# Altium project POWER_SUPPLY.PrjPcb (part 5 of 8)
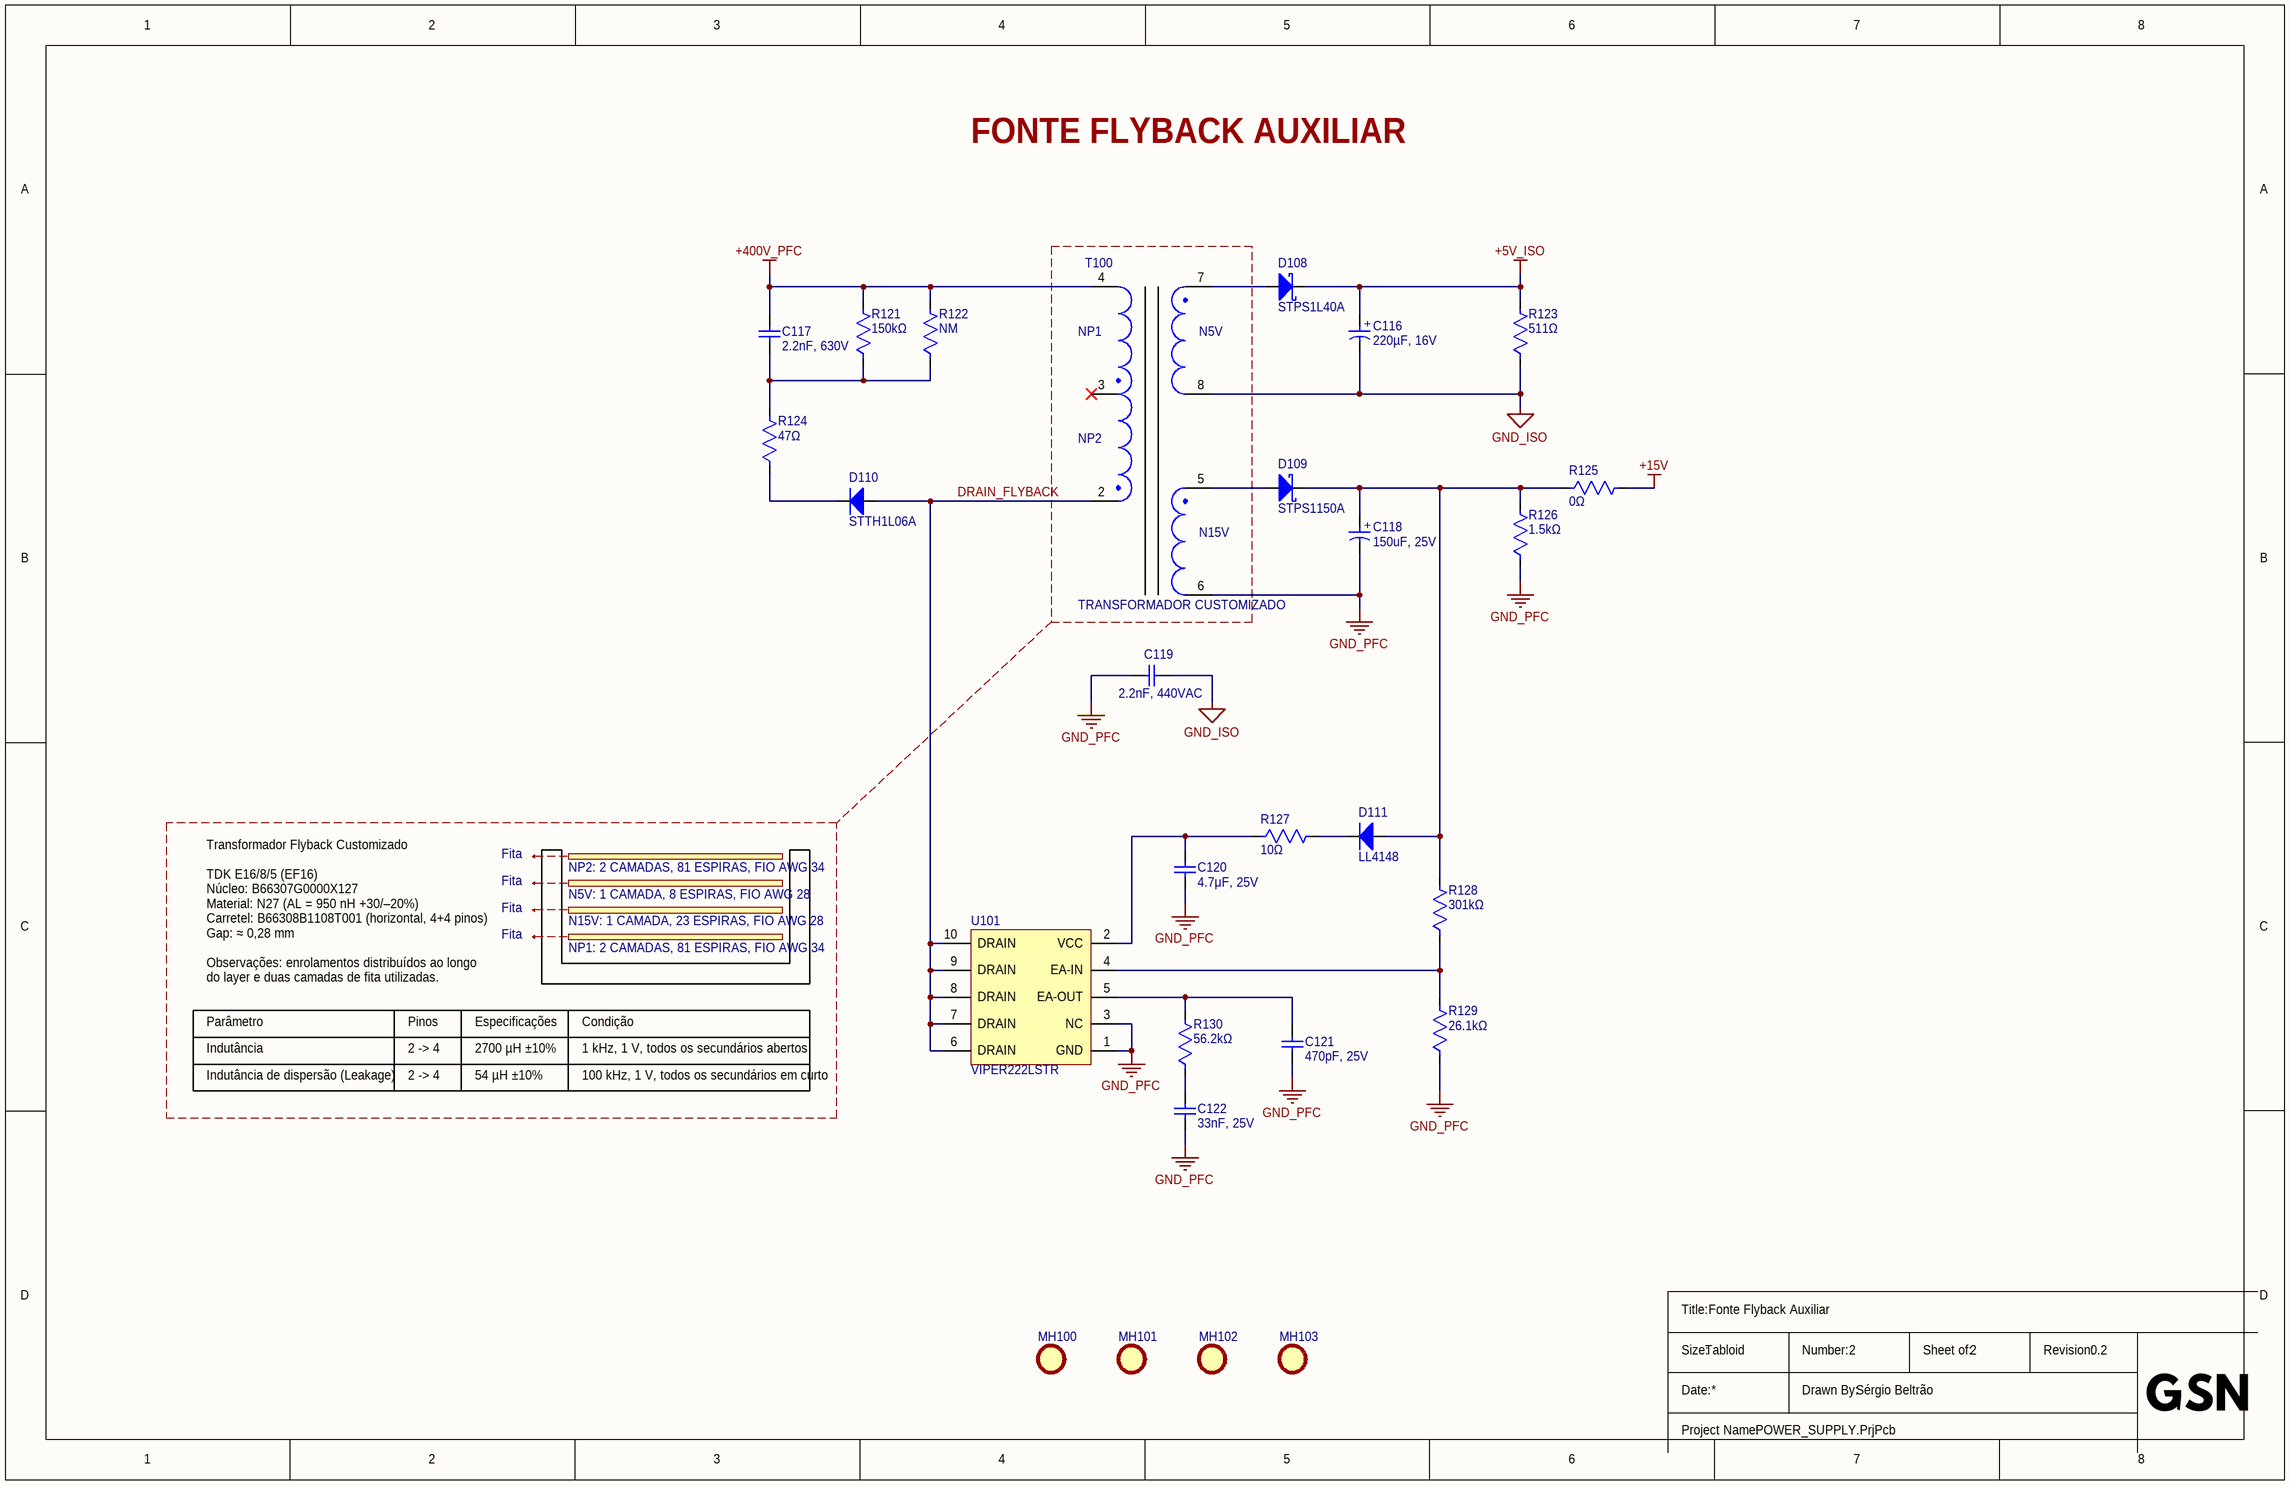
[diagram p6: 2_FLYBACK_AUXILIAR.SchDoc]

## Sheet 2_FLYBACK_AUXILIAR.SchDoc (continued)
### Library data of the parts
C116 = 860040374004: WCAP-ATUL Aluminum Electrolytic Capacitor, Radial, THT, 8mm x 11.5mm, 220µF, 16V; Manufacturer: Wurth Elektronik; Capacitance Tolerance: 20%; Dissipation Factor: 16%; Endurance: 7000h; Leakage Current: 35.2µA; Ripple Current: 480mA; Manufacturer Part Number: 860040374004; Category: Aluminum Electrolytic Capacitors; Match Code: WCAP-ATUL; ComponentLink1Description: Website Link; ComponentLink1URL: https://www.we-online.com/redexpert/article/860040374004?ad; ComponentLink2Description: Datasheet Link; ComponentLink2URL: https://www.we-online.com/redexpert/spec/860040374004?ad; Mount: Through Hole; Operating Temperature Min: -40°C; Operating Temperature Max: 105°C; Packaging: Ammo Pack; Height: 11.5mm; Diameter: 8mm; Capacitance: 220µF; Rated Voltage (DC): 16V
C117 = 885342008007: WCAP-CSMH Multilayer Ceramic Chip Capacitor Mid and High Voltage, SMT, size 1206, NP0 Class I, 2.2nF, 630V; Manufacturer: Wurth Elektronik; Case/Size Code: 1206; Capacitance Tolerance: +/-5%; Insulation Resistance: 10GΩ; Q Factor Min: 1000; Manufacturer Part Number: 885342008007; Category: Multilayer Ceramic Chip Capacitors; Match Code: WCAP-CSMH; ComponentLink1Description: Website Link; ComponentLink1URL: https://www.we-online.com/redexpert/article/885342008007?ad; ComponentLink2Description: Datasheet Link; ComponentLink2URL: https://www.we-online.com/redexpert/spec/885342008007?ad; Mount: Surface Mount; Operating Temperature Min: -55°C; Operating Temperature Max: 125°C; Packaging: Tape and Reel; Length: 3.2mm; Width: 1.6mm; Height: 1.6mm; Capacitance: 2.2nF; Ceramic Type: NP0 Class I; Rated Voltage (DC): 630V
C118 = 860080474008: WCAP-ATLI Aluminum Electrolytic Capacitor, Radial, THT, D8 x H11.5mm, 150µF, 25V; Manufacturer: Wurth Elektronik; Capacitance Tolerance: +/-20%; Dissipation Factor: 10%; Endurance: 3000h; Leakage Current: 37.5uA; Ripple Current: 540mA; Technical Reference: ATEE115151M025DSPA7C000; Manufacturer Part Number: 860080474008; Category: Aluminum Electrolytic Capacitors; Match Code: WCAP-ATLI; ComponentLink1Description: Website Link; ComponentLink1URL: https://www.we-online.com/redexpert/article/860080474008?ad; ComponentLink2Description: Datasheet Link; ComponentLink2URL: https://www.we-online.com/redexpert/spec/860080474008?ad; Mount: Through Hole; Operating Temperature Min: -55°C; Operating Temperature Max: 105°C; Packaging: Ammo Pack; Height: 11.5mm; Diameter: 8mm; Capacitance: 150uF; Rated Voltage (DC): 25V
C119 = VY2222M35Y5US63V7: CAP CER 2200PF 440VAC Y5U RADIAL; Manufacturer: Vishay; Dielectric Material: Ceramic; Lead/Base Style: Kinked; Lead Diameter: 600µm; Lead Length: 30mm; Tolerance: 20%; Voltage: 250V; Voltage Rating: 1kV; Voltage Rating (AC): 300V; Supplier: DigiKey; Supplier Part Number: BC2356-ND; Manufacturer Part Number: VY2222M35Y5US63V7; RoHS: Compliant; Category: Ceramic Capacitors; Stock: 12709; Pricing: 1=0.48, 10=0.288, 50=0.2152, 100=0.1928, 500=0.15486, 1000=0.14314, 3000=0.12868, 5000=0.12334 (USD); Value: 2.2nF; Case/Package: Radial; Composition: Ceramic; Contact Plating: Tin; Depth: 5mm; Diameter: 9mm; Dielectric: Y5U; Export Control Classification Number (ECCN) Code: EAR99; Height: 9mm; Height - Seated (Max): 13.0048mm; Harmonized Tariff Schedule (HTS) Code: 8532.23.00.60; Lead Free: Lead Free; Lead Pitch: 7.5mm; Length: 9mm; Lifecycle Status: Production; Material: Ceramic; Max Operating Temperature: 125°C; Min Operating Temperature: -40°C; Mounting Technology: PCB, Through Hole; Number of Terminals: 2; Packaging: Bulk; Radiation Hardening: No; REACH SVHC: Yes; Schedule B: 8532230060, 8532230060|8532230060, 8532230060|8532230060|8532230060, 8532230060|8532230060|8532230060|8532230060; Terminal Pitch: 7.5mm; Termination: Radial; Voltage Rating (DC): 1kV; Width: 5mm; ComponentLink1URL: https://datasheet.octopart.com:443/VY2222M35Y5US63V7-Vishay-datasheet-182139072.pdf?src-supplier=IHS; ComponentLink1Description: https://datasheet.octopart.com:443/VY2222M35Y5US63V7-Vishay-datasheet-182139072.pdf?src-supplier=IHS; ComponentLink2URL: https://datasheet.octopart.com:443/VY2222M35Y5US63V7-Vishay-datasheet-182137621.pdf?src-supplier=IHS; ComponentLink2Description: https://datasheet.octopart.com:443/VY2222M35Y5US63V7-Vishay-datasheet-182137621.pdf?src-supplier=IHS; ComponentLink3URL: https://datasheet.octopart.com:443/VY2222M35Y5US63V7-Vishay-BCcomponents-datasheet-138899136.pdf?src-supplier=Upverter; ComponentLink3Description: https://datasheet.octopart.com:443/VY2222M35Y5US63V7-Vishay-BCcomponents-datasheet-138899136.pdf?src-supplier=Upverter; ComponentLink4URL: https://datasheet.octopart.com:443/VY2222M35Y5US63V7-Vishay-datasheet-62321353.pdf?src-supplier=Farnell; ComponentLink4Description: https://datasheet.octopart.com:443/VY2222M35Y5US63V7-Vishay-datasheet-62321353.pdf?src-supplier=Farnell; ComponentLink5URL: https://datasheet.octopart.com:443/VY2222M35Y5US63V7-Vishay-datasheet-15070738.pdf?src-supplier=Farnell; ComponentLink5Description: https://datasheet.octopart.com:443/VY2222M35Y5US63V7-Vishay-datasheet-15070738.pdf?src-supplier=Farnell; ComponentLink6URL: https://datasheet.octopart.com:443/VY2222M35Y5US63V7-Vishay-datasheet-10380040.pdf?src-supplier=element14+APAC; ComponentLink6Description: https://datasheet.octopart.com:443/VY2222M35Y5US63V7-Vishay-datasheet-10380040.pdf?src-supplier=element14+APAC; ComponentLink7URL: https://datasheet.octopart.com:443/VY2222M35Y5US63V7-Vishay-datasheet-13530909.pdf?src-supplier=Future+Electronics; ComponentLink7Description: https://datasheet.octopart.com:443/VY2222M35Y5US63V7-Vishay-datasheet-13530909.pdf?src-supplier=Future+Electronics; ComponentLink8URL: https://datasheet.octopart.com:443/VY2222M35Y5US63V7-Vishay-datasheet-13402494.pdf?src-supplier=Future+Electronics; ComponentLink8Description: https://datasheet.octopart.com:443/VY2222M35Y5US63V7-Vishay-datasheet-13402494.pdf?src-supplier=Future+Electronics; ComponentLink9URL: https://datasheet.octopart.com:443/VY2222M35Y5US63V7-Vishay-datasheet-13168647.pdf?src-supplier=Future+Electronics; ComponentLink9Description: https://datasheet.octopart.com:443/VY2222M35Y5US63V7-Vishay-datasheet-13168647.pdf?src-supplier=Future+Electronics; ComponentLink10URL: https://datasheet.octopart.com:443/VY2222M35Y5US63V7-Vishay-datasheet-13030022.pdf?src-supplier=Future+Electronics; ComponentLink10Description: https://datasheet.octopart.com:443/VY2222M35Y5US63V7-Vishay-datasheet-13030022.pdf?src-supplier=Future+Electronics; ComponentLink11URL: https://datasheet.octopart.com:443/VY2222M35Y5US63V7-Vishay-datasheet-12553972.pdf?src-supplier=Future+Electronics; ComponentLink11Description: https://datasheet.octopart.com:443/VY2222M35Y5US63V7-Vishay-datasheet-12553972.pdf?src-supplier=Future+Electronics; ComponentLink12URL: https://datasheet.octopart.com:443/VY2222M35Y5US63V7-Vishay-datasheet-12524127.pdf?src-supplier=Future+Electronics; ComponentLink12Description: https://datasheet.octopart.com:443/VY2222M35Y5US63V7-Vishay-datasheet-12524127.pdf?src-supplier=Future+Electronics; ComponentLink13URL: https://datasheet.octopart.com:443/VY2222M35Y5US63V7-Vishay-datasheet-12510687.pdf?src-supplier=Future+Electronics; ComponentLink13Description: https://datasheet.octopart.com:443/VY2222M35Y5US63V7-Vishay-datasheet-12510687.pdf?src-supplier=Future+Electronics; ComponentLink14URL: https://datasheet.octopart.com:443/VY2222M35Y5US63V7-Vishay-datasheet-27584505.pdf?src-supplier=Future+Electronics; ComponentLink14Description: https://datasheet.octopart.com:443/VY2222M35Y5US63V7-Vishay-datasheet-27584505.pdf?src-supplier=Future+Electronics; ComponentLink15URL: https://datasheet.octopart.com:443/VY2222M35Y5US63V7-Vishay-datasheet-9918016.pdf?src-supplier=RS+(Formerly+Allied+Electronics); ComponentLink15Description: https://datasheet.octopart.com:443/VY2222M35Y5US63V7-Vishay-datasheet-9918016.pdf?src-supplier=RS+(Formerly+Allied+Electronics); ComponentLink16URL: http://sigma.octopart.com:80/rohs_statement/Vishay-company-15.pdf?src-supplier=Compliance+Statements; ComponentLink16Description: http://sigma.octopart.com:80/rohs_statement/Vishay-company-15.pdf?src-supplier=Compliance+Statements
C120 = 885012107018: WCAP-CSGP Multilayer Ceramic Chip Capacitor, General Purpose, size 0805, 4.7μF, 25V; Manufacturer: Wurth Elektronik; Case/Size Code: 0805; Capacitance Tolerance: +/-20%; Ceramic Type: X5R; Dissipation Factor: 10%; Insulation Resistance: 0.02GΩ; Technical Reference: X5R0805475M025DFCT10000; Manufacturer Part Number: 885012107018; Category: Multilayer Ceramic Chip Capacitors; Match Code: WCAP-CSGP; ComponentLink1Description: Website Link; ComponentLink1URL: https://www.we-online.com/redexpert/article/885012107018?ad; ComponentLink2Description: Datasheet Link; ComponentLink2URL: https://www.we-online.com/redexpert/spec/885012107018?ad; Mount: Surface Mount; Operating Temperature Min: -55°C; Operating Temperature Max: 85°C; Packaging: Tape and Reel; Length: 2mm; Width: 1.25mm; Height: 1.25mm; Capacitance: 4.7μF; Rated Voltage (DC): 25V
C121 = 885012006042: WCAP-CSGP Multilayer Ceramic Chip Capacitor, General Purpose, size 0603, 470pF, 25V; Manufacturer: Wurth Elektronik; Case/Size Code: 0603; Capacitance Tolerance: +/-5%; Ceramic Type: NP0; Insulation Resistance: 10GΩ; Q Factor: 1000; Technical Reference: NP00603471J025DFCT10000; Manufacturer Part Number: 885012006042; Category: Multilayer Ceramic Chip Capacitors; Match Code: WCAP-CSGP; ComponentLink1Description: Website Link; ComponentLink1URL: https://www.we-online.com/redexpert/article/885012006042?ad; ComponentLink2Description: Datasheet Link; ComponentLink2URL: https://www.we-online.com/redexpert/spec/885012006042?ad; Mount: Surface Mount; Operating Temperature Min: -55°C; Operating Temperature Max: 125°C; Packaging: Tape and Reel; Length: 1.6mm; Width: 0.8mm; Height: 0.8mm; Capacitance: 470pF; Rated Voltage (DC): 25V
C122 = 885012206068: WCAP-CSGP Multilayer Ceramic Chip Capacitor, General Purpose, size 0603, 33nF, 25V; Manufacturer: Wurth Elektronik; Case/Size Code: 0603; Capacitance Tolerance: +/-10%; Ceramic Type: X7R; Dissipation Factor: 3.5%; Insulation Resistance: 10GΩ; Technical Reference: X7R0603333K025DFCT10000; Manufacturer Part Number: 885012206068; Category: Multilayer Ceramic Chip Capacitors; Match Code: WCAP-CSGP; ComponentLink1Description: Website Link; ComponentLink1URL: https://www.we-online.com/redexpert/article/885012206068?ad; ComponentLink2Description: Datasheet Link; ComponentLink2URL: https://www.we-online.com/redexpert/spec/885012206068?ad; Mount: Surface Mount; Operating Temperature Min: -55°C; Operating Temperature Max: 125°C; Packaging: Tape and Reel; Length: 1.6mm; Width: 0.8mm; Height: 0.8mm; Capacitance: 33nF; Rated Voltage (DC): 25V
D108 = STPS1L40A: DIODE SCHOTTKY 40V 1A DO214AC; Manufacturer: STMicroelectronics; Element Configuration: Single; Forward Voltage: 630mV; Max Forward Surge Current (Ifsm): 60A; Max Junction Temperature (Tj): 175°C; Max Reverse Leakage Current: 35µA; Number of Elements: 1; Peak Non-Repetitive Surge Current: 50A; Polarity: Standard; Supplier: DigiKey; Supplier Part Number: 497-3753-1-ND; Manufacturer Part Number: STPS1L40A; RoHS: Compliant; Category: Schottky Diodes; Stock: 10115; Pricing: 1=0.35, 10=0.215, 100=0.1573, 500=0.11722, 1000=0.09616, 2000=0.09305 (USD); Average Rectified Current: 1A; Case/Package: SMA; China RoHS: Non-Compliant; Contact Plating: Tin; Country of Origin: Mainland China; Current Rating: 1A; Export Control Classification Number (ECCN) Code: EAR99; Forward Current: 1A; Height: 2.45mm; Harmonized Tariff Schedule (HTS) Code: 8541.10.00.80; Introduction Date: 1980-01-04; Lead Free: Lead Free; Length: 4.6mm; Lifecycle Status: Production; Max Operating Temperature: 150°C; Max Output current: 1A; Max Repetitive Reverse Voltage (Vrrm): 40V; Max Reverse Voltage (DC): 40V; Max Surge Current: 60A; Min Operating Temperature: -65°C; Mounting Technology: Surface Mount; Pins: 2; Number of Terminals: 2; Output Current: 1A; Packaging: Tape and Reel; Peak Reverse Current: 35µA; Radiation Hardening: No; REACH SVHC: No; Reverse Standoff Voltage: 40V; Schedule B: 8541100080, 8541100080|8541100080|8541100080|8541100080|8541100080; Termination: SMD/SMT; Voltage Rating (DC): 40V; Width: 2.95mm; ComponentLink1URL: https://datasheet.octopart.com:443/STPS1L40A-STMicroelectronics-datasheet-8130128.pdf?src-supplier=element14+APAC; ComponentLink1Description: https://datasheet.octopart.com:443/STPS1L40A-STMicroelectronics-datasheet-8130128.pdf?src-supplier=element14+APAC; ComponentLink2URL: https://datasheet.octopart.com:443/STPS1L40A-STMicroelectronics-datasheet-12555403.pdf?src-supplier=TME; ComponentLink2Description: https://datasheet.octopart.com:443/STPS1L40A-STMicroelectronics-datasheet-12555403.pdf?src-supplier=TME; ComponentLink3URL: https://datasheet.octopart.com:443/STPS1L40A-STMicroelectronics-datasheet-67360113.pdf?src-supplier=Future+Electronics; ComponentLink3Description: https://datasheet.octopart.com:443/STPS1L40A-STMicroelectronics-datasheet-67360113.pdf?src-supplier=Future+Electronics; ComponentLink4URL: https://datasheet.octopart.com:443/STPS1L40A-STMicroelectronics-datasheet-56319.pdf?src-supplier=Mouser; ComponentLink4Description: https://datasheet.octopart.com:443/STPS1L40A-STMicroelectronics-datasheet-56319.pdf?src-supplier=Mouser; ComponentLink5URL: https://datasheet.octopart.com:443/STPS1L40A-STMicroelectronics-datasheet-14054142.pdf?src-supplier=iiiC; ComponentLink5Description: https://datasheet.octopart.com:443/STPS1L40A-STMicroelectronics-datasheet-14054142.pdf?src-supplier=iiiC
D109 = STPS1150A: DIODE SCHOTTKY 150V 1A SMA; Manufacturer: STMicroelectronics; Element Configuration: Single; Forward Current: 15A; Forward Voltage: 670mV; Max Forward Surge Current (Ifsm): 50A; Max Junction Temperature (Tj): 175°C; Max Reverse Leakage Current: 1µA; Number of Elements: 1; Peak Non-Repetitive Surge Current: 75A; Polarity: Standard; Supplier: DigiKey; Supplier Part Number: 497-7545-1-ND; Manufacturer Part Number: STPS1150A; RoHS: Compliant; Category: Schottky Diodes; Stock: 42987; Pricing: 1=0.4, 10=0.245, 100=0.1953, 500=0.14652, 1000=0.12693, 2000=0.11749 (USD); Average Rectified Current: 1A; Case/Package: SMA; China RoHS: Non-Compliant; Contact Plating: Tin; Current Rating: 1A; Height: 2.65mm; Lead Free: Lead Free; Length: 4.6mm; Lifecycle Status: Production; Max Operating Temperature: 175°C; Max Output current: 1A; Max Repetitive Reverse Voltage (Vrrm): 150V; Max Reverse Voltage (DC): 150V; Max Surge Current: 50A; Min Operating Temperature: -65°C; Mounting Technology: Surface Mount; Pins: 2; Number of Terminals: 2; Output Current: 1A; Packaging: Tape and Reel; Peak Reverse Current: 1µA; Radiation Hardening: No; REACH SVHC: No; Reverse Standoff Voltage: 150V; Schedule B: 8541100080, 8541100080|8541100080|8541100080|8541100080|8541100080; Voltage Rating (DC): 150V; Width: 2.95mm; ComponentLink1URL: https://datasheet.octopart.com:443/STPS1150A-STMicroelectronics-datasheet-27708597.pdf?src-supplier=Future+Electronics; ComponentLink1Description: https://datasheet.octopart.com:443/STPS1150A-STMicroelectronics-datasheet-27708597.pdf?src-supplier=Future+Electronics; ComponentLink2URL: https://datasheet.octopart.com:443/STPS1150A-STMicroelectronics-datasheet-10542425.pdf?src-supplier=Newark; ComponentLink2Description: https://datasheet.octopart.com:443/STPS1150A-STMicroelectronics-datasheet-10542425.pdf?src-supplier=Newark; ComponentLink3URL: https://datasheet.octopart.com:443/STPS1150A-STMicroelectronics-datasheet-140377099.pdf?src-supplier=Newark; ComponentLink3Description: https://datasheet.octopart.com:443/STPS1150A-STMicroelectronics-datasheet-140377099.pdf?src-supplier=Newark; ComponentLink4URL: https://datasheet.octopart.com:443/STPS1150A-STMicroelectronics-datasheet-22975683.pdf?src-supplier=Farnell; ComponentLink4Description: https://datasheet.octopart.com:443/STPS1150A-STMicroelectronics-datasheet-22975683.pdf?src-supplier=Farnell; ComponentLink5URL: https://datasheet.octopart.com:443/STPS1150A-STMicroelectronics-datasheet-14054967.pdf?src-supplier=iiiC; ComponentLink5Description: https://datasheet.octopart.com:443/STPS1150A-STMicroelectronics-datasheet-14054967.pdf?src-supplier=iiiC; ComponentLink6URL: https://datasheet.octopart.com:443/STPS1150A-STMicroelectronics-datasheet-5321440.pdf?src-supplier=Nu+Horizons; ComponentLink6Description: https://datasheet.octopart.com:443/STPS1150A-STMicroelectronics-datasheet-5321440.pdf?src-supplier=Nu+Horizons; ComponentLink7URL: https://datasheet.octopart.com:443/STPS1150A-STMicroelectronics-datasheet-23158.pdf?src-supplier=Mouser; ComponentLink7Description: https://datasheet.octopart.com:443/STPS1150A-STMicroelectronics-datasheet-23158.pdf?src-supplier=Mouser; ComponentLink8URL: https://datasheet.octopart.com:443/STPS1150A-STMicroelectronics-datasheet-145393.pdf?src-supplier=DigiKey; ComponentLink8Description: https://datasheet.octopart.com:443/STPS1150A-STMicroelectronics-datasheet-145393.pdf?src-supplier=DigiKey
D110 = STTH1L06A: DIODE STANDARD 600V 1A SMA; Manufacturer: STMicroelectronics; Element Configuration: Single; Forward Voltage: 1.05V; Max Forward Surge Current (Ifsm): 20A; Max Junction Temperature (Tj): 175°C; Number of Elements: 1; Peak Reverse Current: 1µA; Recovery Time: 80ns; Supplier: DigiKey; Supplier Part Number: 497-3241-1-ND; Manufacturer Part Number: STTH1L06A; RoHS: Compliant; Category: Rectifier Diodes; Stock: 25378; Pricing: 1=0.2, 10=0.133, 100=0.1241, 500=0.11528, 1000=0.10642 (USD); Average Rectified Current: 1A; Case/Package: SMA; China RoHS: Non-Compliant; Contact Plating: Tin; Current Rating: 1A; Forward Current: 1A; Height: 2.65mm; Lead Free: Lead Free; Length: 4.6mm; Lifecycle Status: Production; Max Operating Temperature: 175°C; Max Output current: 1A; Max Repetitive Reverse Voltage (Vrrm): 600V; Max Reverse Voltage (DC): 600V; Max Surge Current: 20A; Min Operating Temperature: -65°C; Mounting Technology: Surface Mount; Pins: 2; Number of Terminals: 2; Output Current: 1A; Packaging: Tape and Reel; Peak Non-Repetitive Surge Current: 20A; Polarity: Standard; Radiation Hardening: No; REACH SVHC: No; Reverse Recovery Time: 80ns; Reverse Standoff Voltage: 600V; Reverse Voltage: 600V; Schedule B: 8541100080, 8541100080|8541100080|8541100080|8541100080|8541100080; Voltage Rating (DC): 600V; Width: 2.95mm; ComponentLink1URL: https://datasheet.octopart.com:443/STTH1L06A-STMicroelectronics-datasheet-10836133.pdf?src-supplier=element14+APAC; ComponentLink1Description: https://datasheet.octopart.com:443/STTH1L06A-STMicroelectronics-datasheet-10836133.pdf?src-supplier=element14+APAC; ComponentLink2URL: https://datasheet.octopart.com:443/STTH1L06A-STMicroelectronics-datasheet-12520326.pdf?src-supplier=TME; ComponentLink2Description: https://datasheet.octopart.com:443/STTH1L06A-STMicroelectronics-datasheet-12520326.pdf?src-supplier=TME; ComponentLink3URL: https://datasheet.octopart.com:443/STTH1L06A-STMicroelectronics-datasheet-40109.pdf?src-supplier=Verical; ComponentLink3Description: https://datasheet.octopart.com:443/STTH1L06A-STMicroelectronics-datasheet-40109.pdf?src-supplier=Verical; ComponentLink4URL: https://datasheet.octopart.com:443/STTH1L06A-STMicroelectronics-datasheet-14054160.pdf?src-supplier=iiiC; ComponentLink4Description: https://datasheet.octopart.com:443/STTH1L06A-STMicroelectronics-datasheet-14054160.pdf?src-supplier=iiiC
D111 = LL4148: DIODE STANDARD 100V 200MA SOD80; Manufacturer: onsemi; Manufacturer Lifecycle Status: ACTIVE; Body Material: Glass; Current: 2A; Element Configuration: Single; Forward Voltage: 1V; Max Power Dissipation: 500mW; Number of Elements: 1; Peak Reverse Current: 25nA; Recovery Time: 4ns; Supplier: DigiKey; Supplier Part Number: LL4148FSCT-ND; Manufacturer Part Number: LL4148; RoHS: Compliant; Category: Rectifier Diodes; Stock: 985538; Pricing: 1=0.1, 10=0.05, 100=0.0426, 500=0.0307, 1000=0.02682 (USD); Average Rectified Current: 200mA; China RoHS: Non-Compliant; Contact Plating: Tin; Country of Origin: Mainland China; Export Control Classification Number (ECCN) Code: EAR99; Forward Current: 200mA; Height: 1.5mm; Harmonized Tariff Schedule (HTS) Code: 8541.10.00.70; Introduction Date: 2006-01-13; Lead Free: Lead Free; Length: 3.6mm; Lifecycle Status: Production; Max Forward Surge Current (Ifsm): 2A; Max Operating Temperature: 175°C; Max Output current: 200mA; Max Repetitive Reverse Voltage (Vrrm): 100V; Max Reverse Voltage (DC): 100V; Max Surge Current: 2A; Min Operating Temperature: -55°C; Mounting Technology: Surface Mount; Pins: 2; Number of Terminals: 2; Packaging: Cut Tape; Peak Non-Repetitive Surge Current: 2A; Power Dissipation: 500mW; Radiation Hardening: No; REACH SVHC: Yes; Reverse Recovery Time: 4ns; Reverse Standoff Voltage: 100V; Reverse Voltage: 100V; Schedule B: 8541100070, 8541100070|8541100070, 8541100070|8541100070|8541100070, 8541100070|8541100070|8541100070|8541100070; Voltage: 100V; Weight: 4.535924g; Width: 1.5mm; ComponentLink1URL: https://datasheet.octopart.com:443/LL4148-onsemi-datasheet-158584874.pdf?src-supplier=onsemi; ComponentLink1Description: https://datasheet.octopart.com:443/LL4148-onsemi-datasheet-158584874.pdf?src-supplier=onsemi; ComponentLink2URL: https://datasheet.octopart.com:443/LL4148-ON-Semiconductor-datasheet-85572496.pdf?src-supplier=onsemi; ComponentLink2Description: https://datasheet.octopart.com:443/LL4148-ON-Semiconductor-datasheet-85572496.pdf?src-supplier=onsemi; ComponentLink3URL: https://datasheet.octopart.com:443/LL4148-ON-Semiconductor-datasheet-86697764.pdf?src-supplier=onsemi; ComponentLink3Description: https://datasheet.octopart.com:443/LL4148-ON-Semiconductor-datasheet-86697764.pdf?src-supplier=onsemi; ComponentLink4URL: https://datasheet.octopart.com:443/LL4148-ON-Semiconductor-datasheet-17172799.pdf?src-supplier=element14+APAC; ComponentLink4Description: https://datasheet.octopart.com:443/LL4148-ON-Semiconductor-datasheet-17172799.pdf?src-supplier=element14+APAC; ComponentLink5URL: https://datasheet.octopart.com:443/LL4148-ON-Semiconductor-datasheet-86691521.pdf?src-supplier=element14+APAC; ComponentLink5Description: https://datasheet.octopart.com:443/LL4148-ON-Semiconductor-datasheet-86691521.pdf?src-supplier=element14+APAC; ComponentLink6URL: https://datasheet.octopart.com:443/LL4148-Fairchild-Semiconductor-datasheet-38581097.pdf?src-supplier=element14+APAC; ComponentLink6Description: https://datasheet.octopart.com:443/LL4148-Fairchild-Semiconductor-datasheet-38581097.pdf?src-supplier=element14+APAC; ComponentLink7URL: https://datasheet.octopart.com:443/LL4148-Fairchild-Semiconductor-datasheet-62114946.pdf?src-supplier=element14+APAC; ComponentLink7Description: https://datasheet.octopart.com:443/LL4148-Fairchild-Semiconductor-datasheet-62114946.pdf?src-supplier=element14+APAC; ComponentLink8URL: https://datasheet.octopart.com:443/LL4148-Fairchild-Semiconductor-datasheet-62292353.pdf?src-supplier=element14+APAC; ComponentLink8Description: https://datasheet.octopart.com:443/LL4148-Fairchild-Semiconductor-datasheet-62292353.pdf?src-supplier=element14+APAC; ComponentLink9URL: https://datasheet.octopart.com:443/LL4148.-ON-Semiconductor-datasheet-87455466.pdf?src-supplier=element14+APAC; ComponentLink9Description: https://datasheet.octopart.com:443/LL4148.-ON-Semiconductor-datasheet-87455466.pdf?src-supplier=element14+APAC; ComponentLink10URL: https://datasheet.octopart.com:443/LL4148-ON-Semiconductor-datasheet-100088444.pdf?src-supplier=JRH+Electronics; ComponentLink10Description: https://datasheet.octopart.com:443/LL4148-ON-Semiconductor-datasheet-100088444.pdf?src-supplier=JRH+Electronics; ComponentLink11URL: https://datasheet.octopart.com:443/LL4148-onsemi-datasheet-180961323.pdf?src-supplier=IHS; ComponentLink11Description: https://datasheet.octopart.com:443/LL4148-onsemi-datasheet-180961323.pdf?src-supplier=IHS; ComponentLink12URL: https://datasheet.octopart.com:443/LL4148-Fairchild-Semiconductor-datasheet-182297807.pdf?src-supplier=IHS; ComponentLink12Description: https://datasheet.octopart.com:443/LL4148-Fairchild-Semiconductor-datasheet-182297807.pdf?src-supplier=IHS; ComponentLink13URL: https://datasheet.octopart.com:443/LL4148-Fairchild-datasheet-492438.pdf?src-supplier=Fairchild+Semiconductor; ComponentLink13Description: https://datasheet.octopart.com:443/LL4148-Fairchild-datasheet-492438.pdf?src-supplier=Fairchild+Semiconductor; ComponentLink14URL: https://datasheet.octopart.com:443/LL4148-Fairchild-Semiconductor-datasheet-11045226.pdf?src-supplier=Fairchild+Semiconductor; ComponentLink14Description: https://datasheet.octopart.com:443/LL4148-Fairchild-Semiconductor-datasheet-11045226.pdf?src-supplier=Fairchild+Semiconductor; ComponentLink15URL: https://sigma.octopart.com:443/17344539/technical_drawing/Fairchild-Semiconductor-LL4148.pdf?src-supplier=Fairchild+Semiconductor; ComponentLink15Description: https://sigma.octopart.com:443/17344539/technical_drawing/Fairchild-Semiconductor-LL4148.pdf?src-supplier=Fairchild+Semiconductor; ComponentLink16URL: https://datasheet.octopart.com:443/LL4148-Fairchild-Semiconductor-datasheet-14041796.pdf?src-supplier=iiiC; ComponentLink16Description: https://datasheet.octopart.com:443/LL4148-Fairchild-Semiconductor-datasheet-14041796.pdf?src-supplier=iiiC; ComponentLink17URL: https://datasheet.octopart.com:443/LL4148-Fairchild-Semiconductor-datasheet-10438456.pdf?src-supplier=Jameco; ComponentLink17Description: https://datasheet.octopart.com:443/LL4148-Fairchild-Semiconductor-datasheet-10438456.pdf?src-supplier=Jameco; ComponentLink18URL: https://datasheet.octopart.com:443/LL4148-ON-Semiconductor-datasheet-81454985.pdf?src-supplier=TME; ComponentLink18Description: https://datasheet.octopart.com:443/LL4148-ON-Semiconductor-datasheet-81454985.pdf?src-supplier=TME; ComponentLink19URL: https://datasheet.octopart.com:443/LL4148-Fairchild-Semiconductor-datasheet-62139678.pdf?src-supplier=iodParts+Technologies+Inc.; ComponentLink19Description: https://datasheet.octopart.com:443/LL4148-Fairchild-Semiconductor-datasheet-62139678.pdf?src-supplier=iodParts+Technologies+Inc.; ComponentLink20URL: https://datasheet.octopart.com:443/LL4148-Fairchild-Semiconductor-datasheet-62268912.pdf?src-supplier=Newark; ComponentLink20Description: https://datasheet.octopart.com:443/LL4148-Fairchild-Semiconductor-datasheet-62268912.pdf?src-supplier=Newark; ComponentLink21URL: http://sigma.octopart.com:80/150613095/rohs_statement/ON-Semiconductor-LL4148.pdf?src-supplier=Compliance+Statements; ComponentLink21Description: http://sigma.octopart.com:80/150613095/rohs_statement/ON-Semiconductor-LL4148.pdf?src-supplier=Compliance+Statements; ComponentLink22URL: http://sigma.octopart.com:80/17353531/reach_statement/Fairchild-Semiconductor-LL4148.pdf?src-supplier=Compliance+Statements; ComponentLink22Description: http://sigma.octopart.com:80/17353531/reach_statement/Fairchild-Semiconductor-LL4148.pdf?src-supplier=Compliance+Statements; ComponentLink23URL: http://sigma.octopart.com:80/17353532/materials_sheet/Fairchild-Semiconductor-LL4148.pdf?src-supplier=Compliance+Statements; ComponentLink23Description: http://sigma.octopart.com:80/17353532/materials_sheet/Fairchild-Semiconductor-LL4148.pdf?src-supplier=Compliance+Statements; ComponentLink24URL: http://sigma.octopart.com:80/33193297/reach_statement/Fairchild-Semiconductor-LL4148.pdf?src-supplier=Compliance+Statements; ComponentLink24Description: http://sigma.octopart.com:80/33193297/reach_statement/Fairchild-Semiconductor-LL4148.pdf?src-supplier=Compliance+Statements; ComponentLink25URL: http://sigma.octopart.com:80/33193298/materials_sheet/Fairchild-Semiconductor-LL4148.pdf?src-supplier=Compliance+Statements; ComponentLink25Description: http://sigma.octopart.com:80/33193298/materials_sheet/Fairchild-Semiconductor-LL4148.pdf?src-supplier=Compliance+Statements; ComponentLink26URL: http://sigma.octopart.com:80/reach_statement/ON-Semiconductor-company-79.pdf?src-supplier=Compliance+Statements; ComponentLink26Description: http://sigma.octopart.com:80/reach_statement/ON-Semiconductor-company-79.pdf?src-supplier=Compliance+Statements; ComponentLink27URL: http://sigma.octopart.com:80/rohs_statement/Fairchild-Semiconductor-company-11.pdf?src-supplier=Compliance+Statements; ComponentLink27Description: http://sigma.octopart.com:80/rohs_statement/Fairchild-Semiconductor-company-11.pdf?src-supplier=Compliance+Statements; ComponentLink28URL: http://sigma.octopart.com:80/rohs_statement/Fairchild-Semiconductor-company-10.pdf?src-supplier=Compliance+Statements; ComponentLink28Description: http://sigma.octopart.com:80/rohs_statement/Fairchild-Semiconductor-company-10.pdf?src-supplier=Compliance+Statements; ComponentLink29URL: http://sigma.octopart.com:80/reach_statement/Fairchild-Semiconductor-company-9.pdf?src-supplier=Compliance+Statements; ComponentLink29Description: http://sigma.octopart.com:80/reach_statement/Fairchild-Semiconductor-company-9.pdf?src-supplier=Compliance+Statements; ComponentLink30URL: https://octopart.com:443/opatz8j6/c1?t=Xpxkz2NEgx4OvPA3Qtyl6iXlCaTO6Dx006tOayOQh8UpEakiw79qybXVjaLUkLdsDcwAhzZWzx4hsVWPp7VVSRUS2jTBS-XM3DH5FBRSfylGBMniz7AQVr_Q7R3Jx2l4jaOKMfh2pC0Sl6mKcG5iyxqYHFtscphSICSNicIjKzxGRZvfLlKmxXOW-H294Yk1x_cmMiAGYKmeAx8dFNplOshOoCdbbUeOktIk3E71qjxJoHCVKROfEgPEuVAOotDk7D3GLFhb0ONIF7lvGKCN4-I4pNAMnSjDC8dGdI9FUWqMmgWXOVngnCQl4h9fXjZD62hPSik3c7L-oytIjEzlRkn8LqxphGg_pA&src-supplier=Compliance+Statements; ComponentLink30Description: https://octopart.com:443/opatz8j6/c1?t=Xpxkz2NEgx4OvPA3Qtyl6iXlCaTO6Dx006tOayOQh8UpEakiw79qybXVjaLUkLdsDcwAhzZWzx4hsVWPp7VVSRUS2jTBS-XM3DH5FBRSfylGBMniz7AQVr_Q7R3Jx2l4jaOKMfh2pC0Sl6mKcG5iyxqYHFtscphSICSNicIjKzxGRZvfLlKmxXOW-H294Yk1x_cmMiAGYKmeAx8dFNplOshOoCdbbUeOktIk3E71qjxJoHCVKROfEgPEuVAOotDk7D3GLFhb0ONIF7lvGKCN4-I4pNAMnSjDC8dGdI9FUWqMmgWXOVngnCQl4h9fXjZD62hPSik3c7L-oytIjEzlRkn8LqxphGg_pA&src-supplier=Compliance+Statements; ComponentLink31URL: https://octopart.com:443/opatz8j6/c1?t=tFIoAttQBStIyOR12NpmeKiMmTe5SP8-8Xq4lkvK6p_Vq1o_9olfxB33t-2EuHG15KFq_ggm6QlYiEY221wMJCkD3umFHElGgHs0hHZS39-Qp2ZZRsupO9Hr1N3PAdDpe750FQU0XgmhgEwHMZn8Z3k5HuoWmRNpRKEnkRFrE0IXKj6CmvQTfQmsENA-D1Qdyo8uqC6uxEsjmMW0Z_q8gXSjLM0_5fRz8eR6DFUS172wwd2S-tXcH_fY0j82uyAjy2XTX7JZakjtcfcCauvyxulJf2m4Pvazm22R5r_wpz6eRhj7z7PQ5lP7HSMDztpbFG7UgPSC_-QkyDNCFsHVILyjtZbhab6GOQU&src-supplier=Compliance+Statements; ComponentLink31Description: https://octopart.com:443/opatz8j6/c1?t=tFIoAttQBStIyOR12NpmeKiMmTe5SP8-8Xq4lkvK6p_Vq1o_9olfxB33t-2EuHG15KFq_ggm6QlYiEY221wMJCkD3umFHElGgHs0hHZS39-Qp2ZZRsupO9Hr1N3PAdDpe750FQU0XgmhgEwHMZn8Z3k5HuoWmRNpRKEnkRFrE0IXKj6CmvQTfQmsENA-D1Qdyo8uqC6uxEsjmMW0Z_q8gXSjLM0_5fRz8eR6DFUS172wwd2S-tXcH_fY0j82uyAjy2XTX7JZakjtcfcCauvyxulJf2m4Pvazm22R5r_wpz6eRhj7z7PQ5lP7HSMDztpbFG7UgPSC_-QkyDNCFsHVILyjtZbhab6GOQU&src-supplier=Compliance+Statements
MH100-MH103 = MTH-2P5MM-UNPLATED: UNPLATED MOUNTING HOLE WITH 2.5MM DIAMETER
R121 R122 = RC2010FK-07150KL: RES 150K OHM 1% 3/4W 2010; Manufacturer: Yageo Group; Max Power Dissipation: 750mW; Temperature Coefficient: 100ppm/°C; Voltage Rating: 400V; Working Voltage: 200V; Supplier: DigiKey; Supplier Part Number: 13-RC2010FK-07150KLDKR-ND; Manufacturer Part Number: RC2010FK-07150KL; RoHS: Compliant; Category: Chip SMD Resistors; Stock: 15946; Pricing: 1=0.23, 10=0.117, 25=0.0932, 50=0.0796, 100=0.0689, 250=0.05808, 500=0.05186, 1000=0.04694 (USD); Case/Package: 2010; Case Code (Imperial): 2010; Case Code (Metric): 5025; China RoHS: Non-Compliant; Composition: Thick Film; Country of Origin: Mainland China, Taiwan; Export Control Classification Number (ECCN) Code: EAR99; Features: Moisture Resistant; Height: 550µm; Harmonized Tariff Schedule (HTS) Code: 8533.21.00.30; Introduction Date: 2004-10-04; Length: 5mm; Lifecycle Status: Production; Max Operating Temperature: 155°C; Min Operating Temperature: -55°C; Mounting Technology: Surface Mount; Number of Terminals: 2; Number of Terminations: 2; Power Rating: 750mW; REACH SVHC: Yes; Termination: SMD/SMT; Tolerance: 1%; Width: 2.5mm; ComponentLink1URL: https://datasheet.octopart.com:443/RC2010FK-07150KL-Yageo-datasheet-175887523.pdf?src-supplier=Newark; ComponentLink1Description: https://datasheet.octopart.com:443/RC2010FK-07150KL-Yageo-datasheet-175887523.pdf?src-supplier=Newark; ComponentLink2URL: https://datasheet.octopart.com:443/RC2010FK-07150KL-Yageo-datasheet-103092701.pdf?src-supplier=Upverter; ComponentLink2Description: https://datasheet.octopart.com:443/RC2010FK-07150KL-Yageo-datasheet-103092701.pdf?src-supplier=Upverter; ComponentLink3URL: https://datasheet.octopart.com:443/RC2010FK-07150KL-Yageo-datasheet-176638170.pdf?src-supplier=Future+Electronics; ComponentLink3Description: https://datasheet.octopart.com:443/RC2010FK-07150KL-Yageo-datasheet-176638170.pdf?src-supplier=Future+Electronics; ComponentLink4URL: https://datasheet.octopart.com:443/RC2010FK-07150KL-Yageo-datasheet-164759695.pdf?src-supplier=Future+Electronics; ComponentLink4Description: https://datasheet.octopart.com:443/RC2010FK-07150KL-Yageo-datasheet-164759695.pdf?src-supplier=Future+Electronics; ComponentLink5URL: https://datasheet.octopart.com:443/RC2010FK-07150KL-Yageo-datasheet-137700087.pdf?src-supplier=Future+Electronics; ComponentLink5Description: https://datasheet.octopart.com:443/RC2010FK-07150KL-Yageo-datasheet-137700087.pdf?src-supplier=Future+Electronics; ComponentLink6URL: https://datasheet.octopart.com/RC2010FK-07150KL-Yageo-datasheet-73766026.pdf; ComponentLink6Description: https://datasheet.octopart.com/RC2010FK-07150KL-Yageo-datasheet-73766026.pdf; ComponentLink7URL: http://sigma.octopart.com:80/conflict_mineral_statement/Yageo-company-3.pdf?src-supplier=Compliance+Statements; ComponentLink7Description: http://sigma.octopart.com:80/conflict_mineral_statement/Yageo-company-3.pdf?src-supplier=Compliance+Statements; ComponentLink8URL: http://sigma.octopart.com:80/rohs_statement/Yageo-company-2.pdf?src-supplier=Compliance+Statements; ComponentLink8Description: http://sigma.octopart.com:80/rohs_statement/Yageo-company-2.pdf?src-supplier=Compliance+Statements
  R121: Value: 150kΩ
  R122: Value: NM
R123 = RC1206FR-07511RL: RES 511 OHM 1% 1/4W 1206; Manufacturer: Yageo Group; Max Power Dissipation: 250mW; Temperature Coefficient: 100ppm/°C; Voltage Rating: 200V; Supplier: DigiKey; Supplier Part Number: 311-511FRCT-ND; Manufacturer Part Number: RC1206FR-07511RL; RoHS: Compliant; Category: Chip SMD Resistors; Stock: 3972; Pricing: 1=0.1, 10=0.047, 25=0.036, 50=0.0296, 100=0.0247, 250=0.0198, 500=0.01698, 1000=0.01477 (USD); Case/Package: 1206; Case Code (Imperial): 1206; Case Code (Metric): 3216; China RoHS: Non-Compliant; Composition: Thick Film; Country of Origin: Mainland China, Taiwan; Depth: 1.6mm; Export Control Classification Number (ECCN) Code: EAR99; Features: Moisture Resistant; Height: 550µm; Harmonized Tariff Schedule (HTS) Code: 8533.21.00.30; Introduction Date: 2004-09-22; Lead Free: Lead Free; Length: 3.1mm; Lifecycle Status: Production; Max Operating Temperature: 155°C; Military Standard: Not; Min Operating Temperature: -55°C; Mounting Technology: Surface Mount; Number of Terminals: 2; Number of Terminations: 2; Packaging: Tape & Reel; Power Rating: 250mW; REACH SVHC: Yes; Value: 511Ω; Schedule B: 8533210045, 8533210045|8533210045|8533210045|8533210045|8533210045; Termination: SMD/SMT; Tolerance: 1%; Voltage Rating (DC): 200V; Width: 1.6mm; Working Voltage: 200V; ComponentLink1URL: https://datasheet.octopart.com:443/RC1206FR-07511RL-Yageo-datasheet-175887523.pdf?src-supplier=Newark; ComponentLink1Description: https://datasheet.octopart.com:443/RC1206FR-07511RL-Yageo-datasheet-175887523.pdf?src-supplier=Newark; ComponentLink2URL: https://datasheet.octopart.com:443/RC1206FR-07511RL-Yageo-datasheet-103092701.pdf?src-supplier=Upverter; ComponentLink2Description: https://datasheet.octopart.com:443/RC1206FR-07511RL-Yageo-datasheet-103092701.pdf?src-supplier=Upverter; ComponentLink3URL: https://datasheet.octopart.com:443/RC1206FR-07511RL-Yageo-Group-datasheet-190305687.pdf?src-supplier=Future+Electronics; ComponentLink3Description: https://datasheet.octopart.com:443/RC1206FR-07511RL-Yageo-Group-datasheet-190305687.pdf?src-supplier=Future+Electronics; ComponentLink4URL: https://datasheet.octopart.com:443/RC1206FR-07511RL-Yageo-datasheet-164759695.pdf?src-supplier=Future+Electronics; ComponentLink4Description: https://datasheet.octopart.com:443/RC1206FR-07511RL-Yageo-datasheet-164759695.pdf?src-supplier=Future+Electronics; ComponentLink5URL: https://datasheet.octopart.com:443/RC1206FR-07511RL-Yageo-datasheet-127823281.pdf?src-supplier=Future+Electronics; ComponentLink5Description: https://datasheet.octopart.com:443/RC1206FR-07511RL-Yageo-datasheet-127823281.pdf?src-supplier=Future+Electronics; ComponentLink6URL: https://datasheet.octopart.com:443/RC1206FR-07511RL-Yageo-datasheet-137700087.pdf?src-supplier=Future+Electronics; ComponentLink6Description: https://datasheet.octopart.com:443/RC1206FR-07511RL-Yageo-datasheet-137700087.pdf?src-supplier=Future+Electronics; ComponentLink7URL: https://datasheet.octopart.com:443/RC1206FR-07511RL-Yageo-datasheet-27233761.pdf?src-supplier=Future+Electronics; ComponentLink7Description: https://datasheet.octopart.com:443/RC1206FR-07511RL-Yageo-datasheet-27233761.pdf?src-supplier=Future+Electronics; ComponentLink8URL: https://datasheet.octopart.com:443/RC1206FR-07511RL-Yageo-datasheet-13032847.pdf?src-supplier=Future+Electronics; ComponentLink8Description: https://datasheet.octopart.com:443/RC1206FR-07511RL-Yageo-datasheet-13032847.pdf?src-supplier=Future+Electronics; ComponentLink9URL: https://datasheet.octopart.com:443/RC1206FR-07511RL-Yageo-datasheet-8359522.pdf?src-supplier=Future+Electronics; ComponentLink9Description: https://datasheet.octopart.com:443/RC1206FR-07511RL-Yageo-datasheet-8359522.pdf?src-supplier=Future+Electronics; ComponentLink10URL: https://datasheet.octopart.com:443/RC1206FR-07511RL-Yageo-Group-datasheet-189192902.pdf?src-supplier=TME; ComponentLink10Description: https://datasheet.octopart.com:443/RC1206FR-07511RL-Yageo-Group-datasheet-189192902.pdf?src-supplier=TME; ComponentLink11URL: https://datasheet.octopart.com:443/RC1206FR-07511RL-Yageo-Group-datasheet-176638170.pdf?src-supplier=TME; ComponentLink11Description: https://datasheet.octopart.com:443/RC1206FR-07511RL-Yageo-Group-datasheet-176638170.pdf?src-supplier=TME; ComponentLink12URL: https://datasheet.octopart.com/RC1206FR-07511RL-Yageo-datasheet-73766026.pdf; ComponentLink12Description: https://datasheet.octopart.com/RC1206FR-07511RL-Yageo-datasheet-73766026.pdf; ComponentLink13URL: https://datasheet.octopart.com:443/RC1206FR-07511RL-Yageo-datasheet-118639.pdf?src-supplier=DigiKey; ComponentLink13Description: https://datasheet.octopart.com:443/RC1206FR-07511RL-Yageo-datasheet-118639.pdf?src-supplier=DigiKey; ComponentLink14URL: http://sigma.octopart.com:80/conflict_mineral_statement/Yageo-company-3.pdf?src-supplier=Compliance+Statements; ComponentLink14Description: http://sigma.octopart.com:80/conflict_mineral_statement/Yageo-company-3.pdf?src-supplier=Compliance+Statements; ComponentLink15URL: http://sigma.octopart.com:80/rohs_statement/Yageo-company-2.pdf?src-supplier=Compliance+Statements; ComponentLink15Description: http://sigma.octopart.com:80/rohs_statement/Yageo-company-2.pdf?src-supplier=Compliance+Statements
R124 = RC1206FR-0747RL: RES 47R OHM 1% 1/4W 1206; Manufacturer: Yageo Group; Power Rating: 250mW; Temperature Coefficient: 100ppm/°C; Voltage Rating: 200V; Supplier: DigiKey; Supplier Part Number: 311-47.0FRDKR-ND; Manufacturer Part Number: RC1206FR-0747RL; RoHS: Compliant; Category: Chip SMD Resistors; Stock: 63732; Pricing: 1=0.1, 10=0.047, 25=0.036, 50=0.0296, 100=0.0247, 250=0.0198, 500=0.01698, 1000=0.01477 (USD); Case/Package: 1206; Case Code (Imperial): 1206; Case Code (Metric): 3216; China RoHS: Non-Compliant; Composition: Thick Film; Country of Origin: Mainland China, Taiwan; Depth: 1.6mm; Export Control Classification Number (ECCN) Code: EAR99; Height: 550µm; Harmonized Tariff Schedule (HTS) Code: 8533.21.00.30; Introduction Date: 2004-09-22; Lead Free: Lead Free; Length: 3.1mm; Lifecycle Status: Production; Max Operating Temperature: 155°C; Military Standard: Not; Min Operating Temperature: -55°C; Mounting Technology: Surface Mount; Pins: 2; Number of Terminals: 2; Number of Terminations: 2; Packaging: Tape & Reel; REACH SVHC: Yes; Value: 47Ω; Schedule B: 8533210045, 8533210045|8533210045, 8533210045|8533210045|8533210045, 8533210045|8533210045|8533210045|8533210045; Termination: SMD/SMT; Tolerance: 1%; Voltage Rating (AC): 200V; Voltage Rating (DC): 200V; Weight: 16.187578mg; Width: 1.6mm; Working Voltage: 200V; ComponentLink1URL: https://datasheet.octopart.com:443/RC1206FR-0747RL-Yageo-datasheet-175887523.pdf?src-supplier=IHS; ComponentLink1Description: https://datasheet.octopart.com:443/RC1206FR-0747RL-Yageo-datasheet-175887523.pdf?src-supplier=IHS; ComponentLink2URL: https://datasheet.octopart.com:443/RC1206FR-0747RL-Yageo-datasheet-103092701.pdf?src-supplier=Upverter; ComponentLink2Description: https://datasheet.octopart.com:443/RC1206FR-0747RL-Yageo-datasheet-103092701.pdf?src-supplier=Upverter; ComponentLink3URL: https://datasheet.octopart.com:443/RC1206FR-0747RL-Yageo-datasheet-8359522.pdf?src-supplier=element14+APAC; ComponentLink3Description: https://datasheet.octopart.com:443/RC1206FR-0747RL-Yageo-datasheet-8359522.pdf?src-supplier=element14+APAC; ComponentLink4URL: https://datasheet.octopart.com:443/RC1206FR-0747RL-Yageo-Group-datasheet-190305687.pdf?src-supplier=Future+Electronics; ComponentLink4Description: https://datasheet.octopart.com:443/RC1206FR-0747RL-Yageo-Group-datasheet-190305687.pdf?src-supplier=Future+Electronics; ComponentLink5URL: https://datasheet.octopart.com:443/RC1206FR-0747RL-Yageo-datasheet-164759695.pdf?src-supplier=Future+Electronics; ComponentLink5Description: https://datasheet.octopart.com:443/RC1206FR-0747RL-Yageo-datasheet-164759695.pdf?src-supplier=Future+Electronics; ComponentLink6URL: https://datasheet.octopart.com:443/RC1206FR-0747RL-Yageo-datasheet-137700087.pdf?src-supplier=Future+Electronics; ComponentLink6Description: https://datasheet.octopart.com:443/RC1206FR-0747RL-Yageo-datasheet-137700087.pdf?src-supplier=Future+Electronics; ComponentLink7URL: https://datasheet.octopart.com:443/RC1206FR-0747RL-Yageo-datasheet-27233761.pdf?src-supplier=Future+Electronics; ComponentLink7Description: https://datasheet.octopart.com:443/RC1206FR-0747RL-Yageo-datasheet-27233761.pdf?src-supplier=Future+Electronics; ComponentLink8URL: https://datasheet.octopart.com:443/RC1206FR-0747RL-Yageo-datasheet-13032847.pdf?src-supplier=Future+Electronics; ComponentLink8Description: https://datasheet.octopart.com:443/RC1206FR-0747RL-Yageo-datasheet-13032847.pdf?src-supplier=Future+Electronics; ComponentLink9URL: https://datasheet.octopart.com:443/RC1206FR-0747RL-Yageo-datasheet-62067350.pdf?src-supplier=Farnell; ComponentLink9Description: https://datasheet.octopart.com:443/RC1206FR-0747RL-Yageo-datasheet-62067350.pdf?src-supplier=Farnell; ComponentLink10URL: https://datasheet.octopart.com:443/RC1206FR-0747RL-Yageo-datasheet-13691069.pdf?src-supplier=Farnell; ComponentLink10Description: https://datasheet.octopart.com:443/RC1206FR-0747RL-Yageo-datasheet-13691069.pdf?src-supplier=Farnell; ComponentLink11URL: https://datasheet.octopart.com:443/RC1206FR-0747RL-Yageo-datasheet-148775077.pdf?src-supplier=JRH+Electronics; ComponentLink11Description: https://datasheet.octopart.com:443/RC1206FR-0747RL-Yageo-datasheet-148775077.pdf?src-supplier=JRH+Electronics; ComponentLink12URL: https://datasheet.octopart.com/RC1206FR-0747RL-Yageo-datasheet-73766026.pdf; ComponentLink12Description: https://datasheet.octopart.com/RC1206FR-0747RL-Yageo-datasheet-73766026.pdf; ComponentLink13URL: https://datasheet.octopart.com:443/RC1206FR-0747RL-Yageo-datasheet-118639.pdf?src-supplier=DigiKey; ComponentLink13Description: https://datasheet.octopart.com:443/RC1206FR-0747RL-Yageo-datasheet-118639.pdf?src-supplier=DigiKey; ComponentLink14URL: http://sigma.octopart.com:80/conflict_mineral_statement/Yageo-company-3.pdf?src-supplier=Compliance+Statements; ComponentLink14Description: http://sigma.octopart.com:80/conflict_mineral_statement/Yageo-company-3.pdf?src-supplier=Compliance+Statements; ComponentLink15URL: http://sigma.octopart.com:80/rohs_statement/Yageo-company-2.pdf?src-supplier=Compliance+Statements; ComponentLink15Description: http://sigma.octopart.com:80/rohs_statement/Yageo-company-2.pdf?src-supplier=Compliance+Statements
R125 = RC1206FR-070RL: RES 0 OHM JUMPER 1/4W 1206; Manufacturer: Yageo Group; Max Power Dissipation: 250mW; Tolerance: 1%; Voltage Rating: 200V; Supplier: DigiKey; Supplier Part Number: YAG3367CT-ND; Manufacturer Part Number: RC1206FR-070RL; RoHS: Compliant; Category: Chip SMD Resistors; Stock: 769584; Pricing: 1=0.1, 10=0.028, 25=0.0232, 50=0.0204, 100=0.0178, 250=0.01508, 500=0.01334, 1000=0.01187 (USD); Case/Package: 1206; Case Code (Imperial): 1206; Case Code (Metric): 3216; China RoHS: Non-Compliant; Composition: Thick Film; Contact Plating: Tin; Country of Origin: Mainland China, Taiwan; Export Control Classification Number (ECCN) Code: EAR99; Features: Moisture Resistant; Height: 550µm; Harmonized Tariff Schedule (HTS) Code: 8533.21.00.30; Introduction Date: 2009-07-17; Lead Free: Lead Free; Length: 3.1mm; Lifecycle Status: Production; Max Operating Temperature: 155°C; Min Operating Temperature: -55°C; Mounting Technology: Surface Mount; Number of Terminals: 2; Number of Terminations: 2; Packaging: Tape & Reel; Power Rating: 250mW; Radiation Hardening: No; REACH SVHC: Yes; Value: 0Ω; Width: 1.6mm; ComponentLink1URL: https://datasheet.octopart.com:443/RC1206FR-070RL-Yageo-datasheet-141265859.pdf?src-supplier=Upverter; ComponentLink1Description: https://datasheet.octopart.com:443/RC1206FR-070RL-Yageo-datasheet-141265859.pdf?src-supplier=Upverter; ComponentLink2URL: https://datasheet.octopart.com:443/RC1206FR-070RL-Yageo-datasheet-8359522.pdf?src-supplier=IHS; ComponentLink2Description: https://datasheet.octopart.com:443/RC1206FR-070RL-Yageo-datasheet-8359522.pdf?src-supplier=IHS; ComponentLink3URL: https://datasheet.octopart.com:443/RC1206FR-070RL-Yageo-Group-datasheet-176638170.pdf?src-supplier=Future+Electronics; ComponentLink3Description: https://datasheet.octopart.com:443/RC1206FR-070RL-Yageo-Group-datasheet-176638170.pdf?src-supplier=Future+Electronics; ComponentLink4URL: https://datasheet.octopart.com:443/RC1206FR-070RL-Yageo-datasheet-164759695.pdf?src-supplier=Future+Electronics; ComponentLink4Description: https://datasheet.octopart.com:443/RC1206FR-070RL-Yageo-datasheet-164759695.pdf?src-supplier=Future+Electronics; ComponentLink5URL: https://datasheet.octopart.com:443/RC1206FR-070RL-Yageo-datasheet-137700087.pdf?src-supplier=Future+Electronics; ComponentLink5Description: https://datasheet.octopart.com:443/RC1206FR-070RL-Yageo-datasheet-137700087.pdf?src-supplier=Future+Electronics; ComponentLink6URL: https://datasheet.octopart.com:443/RC1206FR-070RL-Yageo-datasheet-27233761.pdf?src-supplier=Future+Electronics; ComponentLink6Description: https://datasheet.octopart.com:443/RC1206FR-070RL-Yageo-datasheet-27233761.pdf?src-supplier=Future+Electronics; ComponentLink7URL: https://datasheet.octopart.com:443/RC1206FR-070RL-Yageo-datasheet-13032847.pdf?src-supplier=Future+Electronics; ComponentLink7Description: https://datasheet.octopart.com:443/RC1206FR-070RL-Yageo-datasheet-13032847.pdf?src-supplier=Future+Electronics; ComponentLink8URL: https://datasheet.octopart.com/RC1206FR-070RL-Yageo-datasheet-73766026.pdf; ComponentLink8Description: https://datasheet.octopart.com/RC1206FR-070RL-Yageo-datasheet-73766026.pdf; ComponentLink9URL: http://sigma.octopart.com:80/conflict_mineral_statement/Yageo-company-3.pdf?src-supplier=Compliance+Statements; ComponentLink9Description: http://sigma.octopart.com:80/conflict_mineral_statement/Yageo-company-3.pdf?src-supplier=Compliance+Statements; ComponentLink10URL: http://sigma.octopart.com:80/rohs_statement/Yageo-company-2.pdf?src-supplier=Compliance+Statements; ComponentLink10Description: http://sigma.octopart.com:80/rohs_statement/Yageo-company-2.pdf?src-supplier=Compliance+Statements